# EAGLE design usb_adapter (EAGLE 6.1)
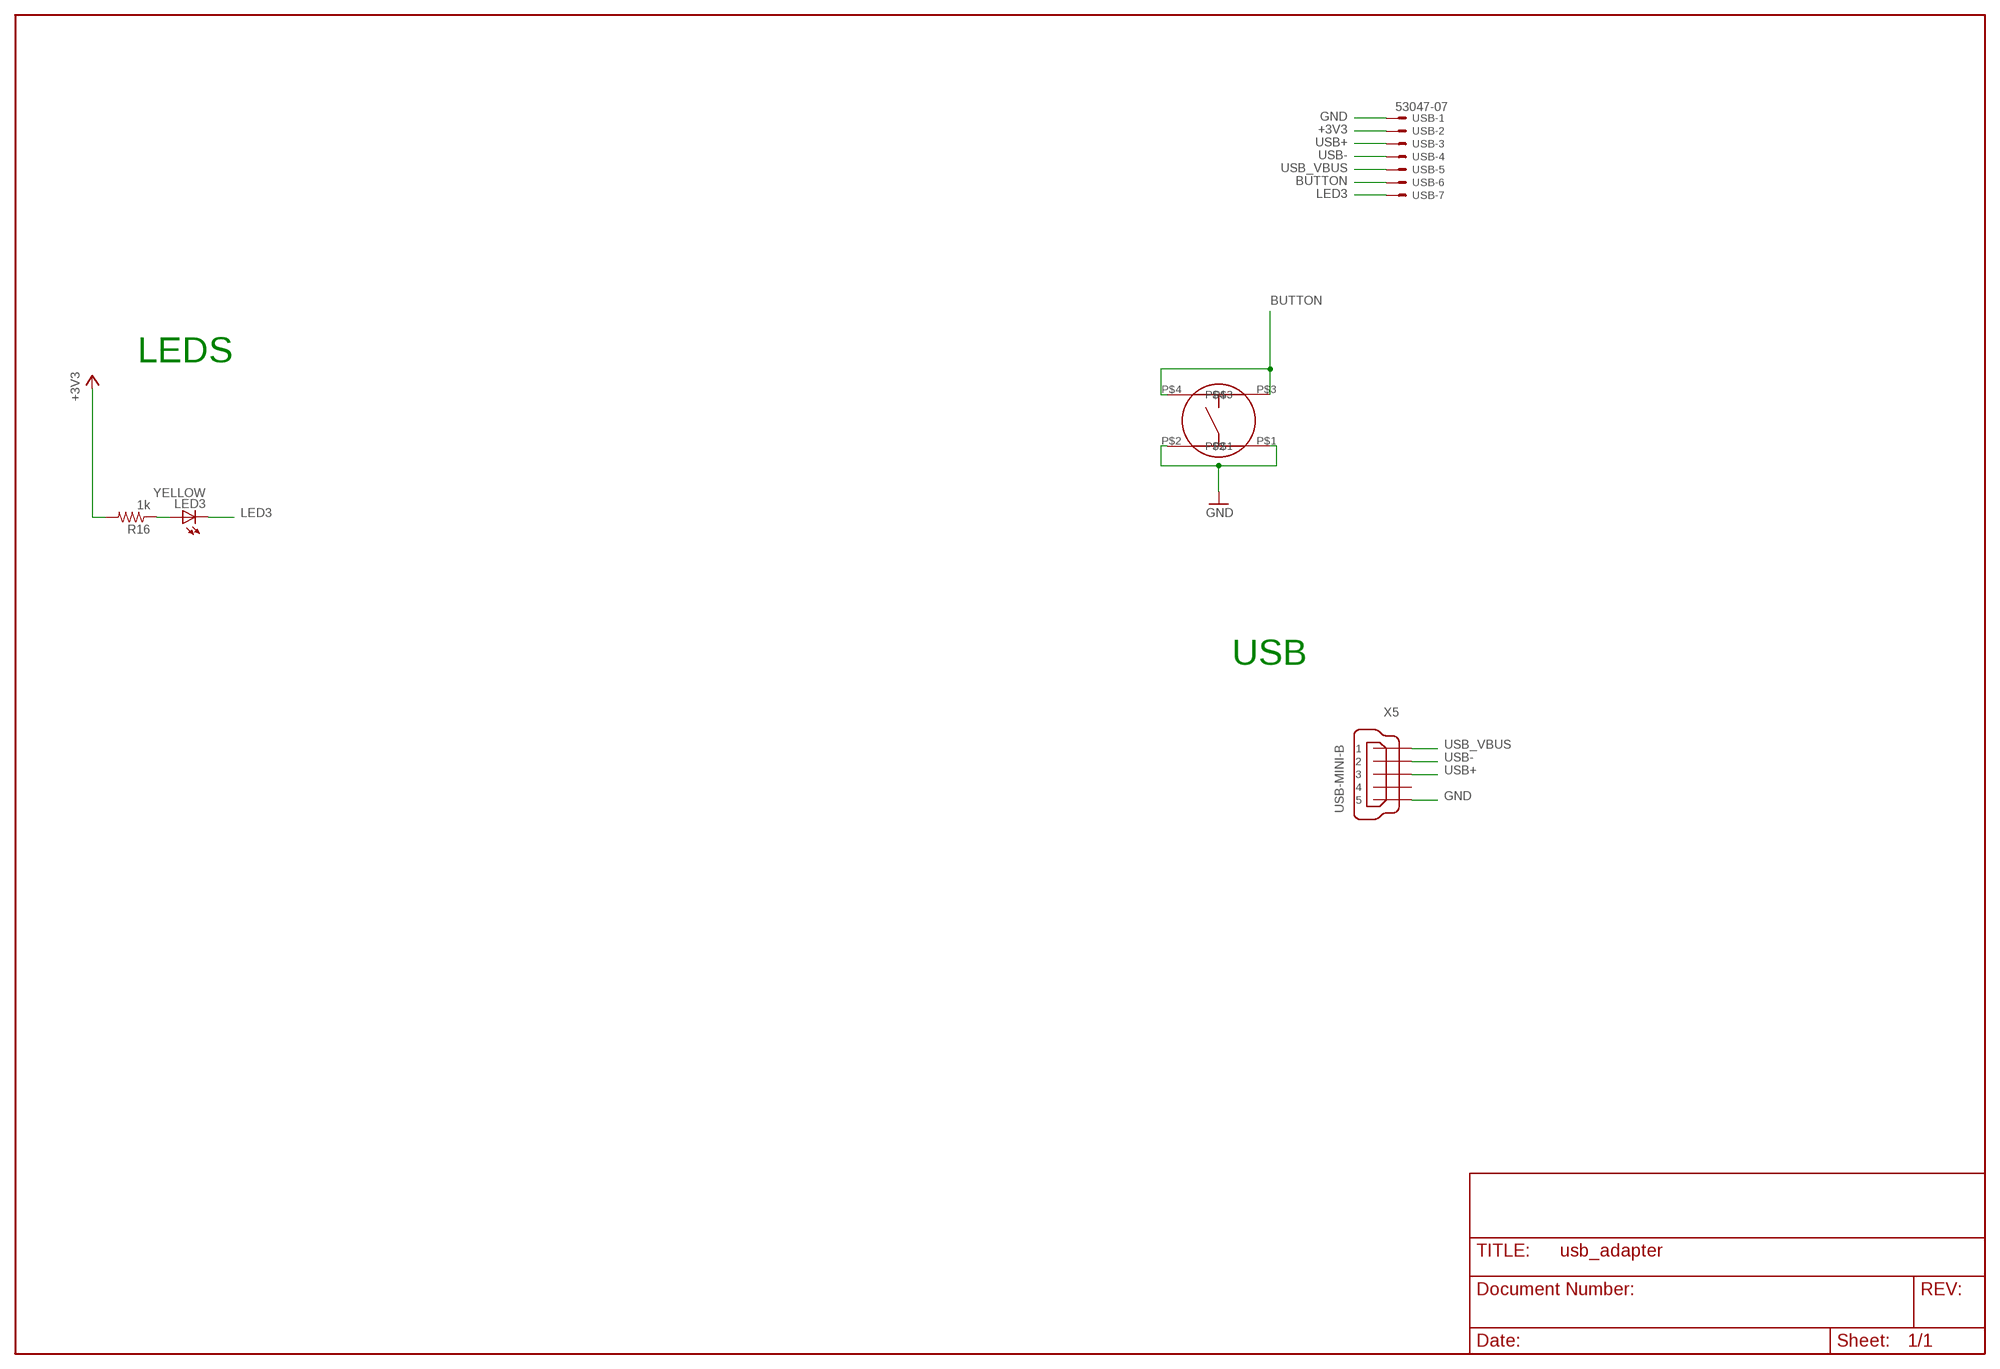
[diagram p0: schematic, sheet 1]

## Parts
LED3  YELLOW  LEDCHIP-LED0805  [CHIP-LED0805]
R16  1k  R-US_R0603  [R0603@1]
SW1  B3S  [B3S]
USB  53047-07  [53047-07]
X5  USB-MINI-B  MINI-USB-UX60-MB-5ST  [UX60-MB-5ST]

## Nets
+3V3: R16.2 USB.2
BUTTON: SW1.P$3 SW1.P$4 USB.6
GND: SW1.P$1 SW1.P$2 USB.1 X5.5
LED3: LED3.C USB.7
N$7: LED3.A R16.1
USB+: USB.3 X5.3
USB-: USB.4 X5.2
USB_VBUS: USB.5 X5.1
Unconnected: X5.4

## Notes on the sheet
- LEDS
- USB

## Library data of the parts
LED3 = led:LED: LED OSRAM: - CHIPLED LG R971, LG N971, LY N971, LG Q971, LY Q971, LO R971, LY R971 LH N974, LH R974 LS Q976, LO Q976, LY Q976 LO Q996 - Hyper CHIPLED LW Q18S LB Q993, LB Q99A, LB R99A - SideLED LS A670, LO A670, LY A670, LG A670, LP A670 LB A673, LV A673, LT A673, LW A673 LH A674 LY A675 LS A676, LA A676, LO A676, LY A676, LW A676 LS A679, LY A679, LG A679 - Hyper Micro SIDELED® LS Y876, LA Y876, LO Y876, LY Y876 LT Y87S - SmartLED LW L88C, LW L88S LB L89C, LB L89S, LG L890 LS L89K, LO L89K, LY L89K LS L896, LA L896, LO L896, LY L896 - TOPLED LS T670, LO T670, LY T670, LG T670, LP T670 LSG T670, LSP T670, LSY T670, LOP T670, LYG T670 LG T671, LOG T671, LSG T671 LB T673, LV T673, LT T673, LW T673 LH T674 LS T676, LA T676, LO T676, LY T676, LB T676, LH T676, LSB T676, LW T676 LB T67C, LV T67C, LT T67C, LS T67K, LO T67K, LY T67K, LW E67C LS E67B, LA E67B, LO E67B, LY E67B, LB E67C, LV E67C, LT E67C LW T67C LS T679, LY T679, LG T679 LS T770, LO T770, LY T770, LG T770, LP T770 LB T773, LV T773, LT T773, LW T773 LH T774 LS E675, LA E675, LY E675, LS T675 LS T776, LA T776, LO T776, LY T776, LB T776 LHGB T686 LT T68C, LB T68C - Hyper Mini TOPLED® LB M676 - Mini TOPLED Santana® LG M470 LS M47K, LO M47K, LY M47K Source: http://www.osram.convergy.de - LUMILED® LXK2-PW12-R00, LXK2-PW12-S00, LXK2-PW14-U00, LXK2-PW14-V00 LXK2-PM12-R00, LXK2-PM12-S00, LXK2-PM14-U00 LXK2-PE12-Q00, LXK2-PE12-R00, LXK2-PE12-S00, LXK2-PE14-T00, LXK2-PE14-U00 LXK2-PB12-K00, LXK2-PB12-L00, LXK2-PB12-M00, LXK2-PB14-N00, LXK2-PB14-P00, LXK2-PB14-Q00 LXK2-PR12-L00, LXK2-PR12-M00, LXK2-PR14-Q00, LXK2-PR14-R00 LXK2-PD12-Q00, LXK2-PD12-R00, LXK2-PD12-S00 LXK2-PH12-R00, LXK2-PH12-S00 LXK2-PL12-P00, LXK2-PL12-Q00, LXK2-PL12-R00 Source: www.luxeon.com
R16 = rcl:R-US_: RESISTOR, American symbol
SW1 = paparazzi:B3S
USB = con-molex:53?-07: CONNECTOR wire to board 1.25 mm (.049 inch) pitch header
X5 = con-hirose:MINI-USB-: MINI USB Connector Source: http://www.hirose.co.jp/cataloge_hp/e24000019.pdf

## Board
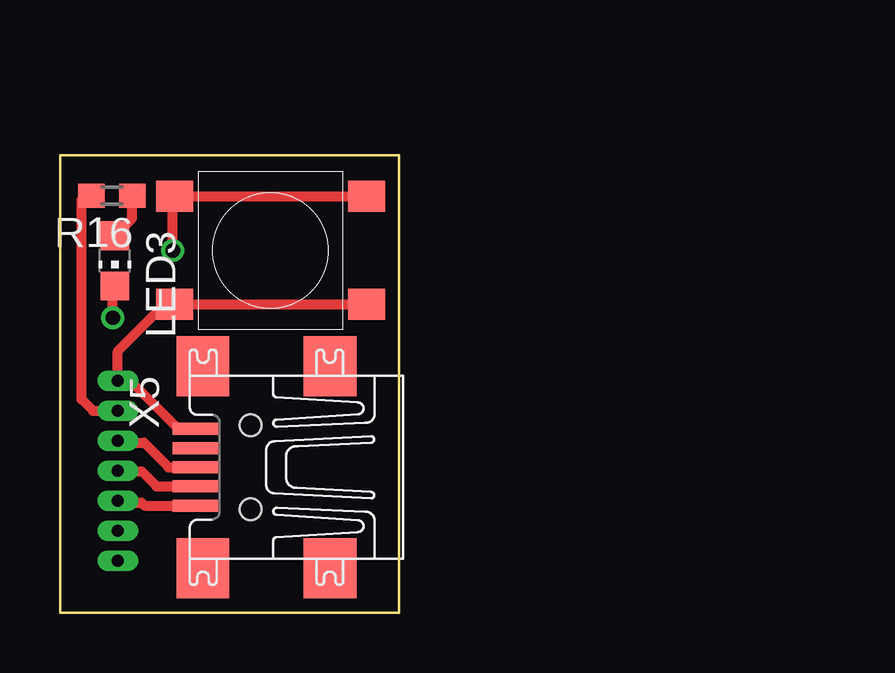
[diagram p1: board, top side]
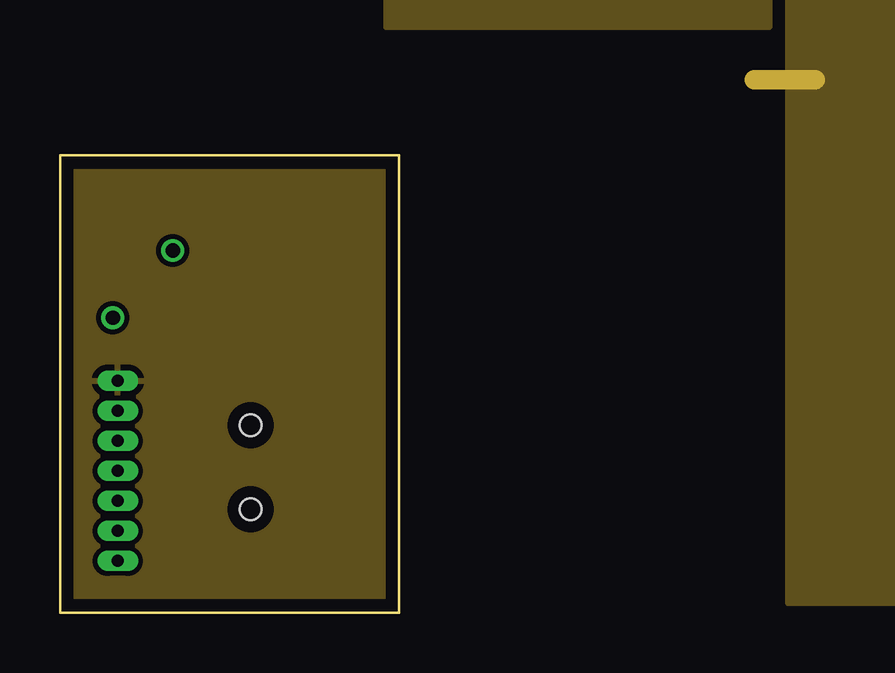
[diagram p2: board, inner layer Route2]
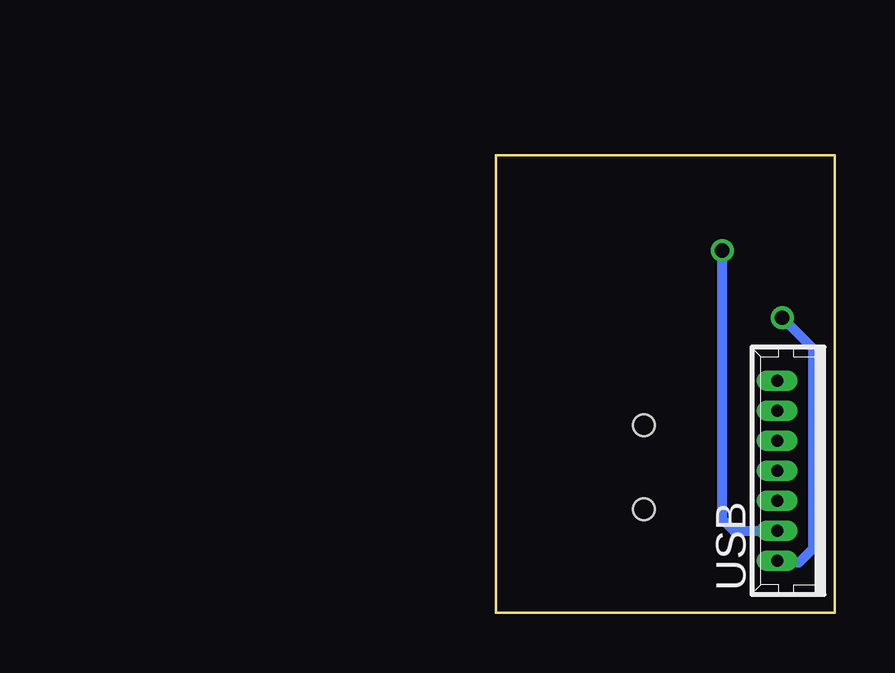
[diagram p3: board, bottom side, seen from below]

Size 14.13 x 19.07 mm. Coordinates in mm from the lower left corner, seen from the top.
Outline: 0,0 0,19.07 14.13,19.07 14.13,0 0,0
Copper layers (1*2+15*16): Top 0.035mm / dielectric 0.2mm / Route2 0.035mm / dielectric 1.5mm / Route15 0.035mm / dielectric 0.2mm / Bottom 0.035mm
Design rules: minimum track width 0.15mm, minimum drill 0.35mm, track to track 0.15mm, track to pad 0.15mm, pad to pad 0.15mm, via to via 0.15mm, smd to smd 0.15mm, copper to edge 20mil, drill to drill 8mil, minimum pad ring 0.177mm, minimum via ring 0.177mm, stop-mask expansion 4mil, vias tented up to drill 0mil, thermal gap 10mil

### Footprints (pad centres in the part's own frame; a part is rotated, then mirrored left to right if it is on the bottom)
CHIP-LED0805 = smd 1.2 x 1.2: A 0,-1.05; C 0,1.05
R0603@1 = smd 1.1 x 1: 1 -0.85,0; 2 0.85,0
B3S = smd 1.55 x 1.3: P$1 4,-2.25; P$2 -4,-2.25; P$3 4,2.25; P$4 -4,2.25
53047-07 = drill 0.5 pad 0.698 long: 1 3.75,0.45; 2 2.5,0.45; 3 1.25,0.45; 4 0,0.45; 5 -1.25,0.45; 6 -2.5,0.45; 7 -3.75,0.45
UX60-MB-5ST = smd 2 x 0.5: 1 2.25,1.6; 2 2.25,0.8; 3 2.25,0; 4 2.25,-0.8; 5 2.25,-1.6 | smd 2.2 x 2.5: M1 -3.3,-4.2; M2 -3.3,4.2; M3 2,4.2; M4 2,-4.2 | hole 0.9: 0,-1.75; 0,1.75

### Placement (x,y rotation side)
LED3  2.29,14.67 180 top
R16  2.17,17.39 180 top
SW1  8.78,15.11 0 top
USB  1.96,5.92 90 bottom
X5  7.96,6.07 180 top

### Tracks (layer width: path | path; a pad name or v marks a point on that pad's centre or on a via)
+3V3
  Top 0.406: USB.2 1.38,8.42 0.9,8.9 0.9,17.2 1.13,17.2 R16.2
AGND
  Route2 0.813: 28.96,22.23 31.5,22.23
  pour Route2 (isolate 0.203): 30.35,39.37 51.31,39.37 51.31,22.61 arc90 48.77,20.07 arc90 51.31,17.53 51.31,0.38 30.35,0.38
  pour Route2 (isolate 0.203): 51.31,39.37 69.6,39.37 69.6,0.38 51.31,0.38 51.31,17.53 arc90 53.85,20.07 arc90 51.31,22.61
  pour Route2 (no thermals): 29.59,24.38 13.59,24.38 13.59,39.37 29.59,39.37
BUTTON  (via drill 0.6)
  Top 0.406: SW1.P$3 4.86,17.36 4.8,17.3 4.78,17.32 SW1.P$4 4.7,17.28 v4.7,15.1
  Bottom 0.406: v4.7,15.1 4.7,3.9 4.2,3.4 2.39,3.4 | 2.39,3.4 2.3,3.4 | USB.6 2.39,3.4
GND
  Top 0.406: X5.5 4.93,7.67 3,9.6 2.4,9.6 2.41,9.61 USB.1 2.41,10.91 4.3,12.8 4.72,12.8 SW1.P$2 | SW1.P$2 4.78,12.72 | SW1.P$1 12.76,12.86 12.7,12.8 12.64,12.86 SW1.P$2
  pour Route2 (isolate 0.203): 0.25,39.62 13.08,39.62 13.08,23.88 29.59,23.88 29.59,0.38 0.25,0.38
LED3  (via drill 0.6)
  Top 0.406: LED3.C 2.2,13.53 v2.2,12.3
  Bottom 0.406: v2.2,12.3 0.9,11 0.9,2.7 1.5,2.1 2.4,2.1 2.41,2.11 USB.7
N$7
  Top 0.406: R16.1 3,17.37 3,16.43 LED3.A
USB+
  Top 0.406: X5.3 4.53,6.07 3.5,7.1 2.5,7.1 2.43,7.17 USB.3
USB-
  Top 0.406: X5.2 4.03,5.27 3.4,5.9 2.5,5.9 2.48,5.92 USB.4
USB_VBUS
  Top 0.406: X5.1 3.53,4.47 3.4,4.6 2.5,4.6 2.43,4.67 USB.5